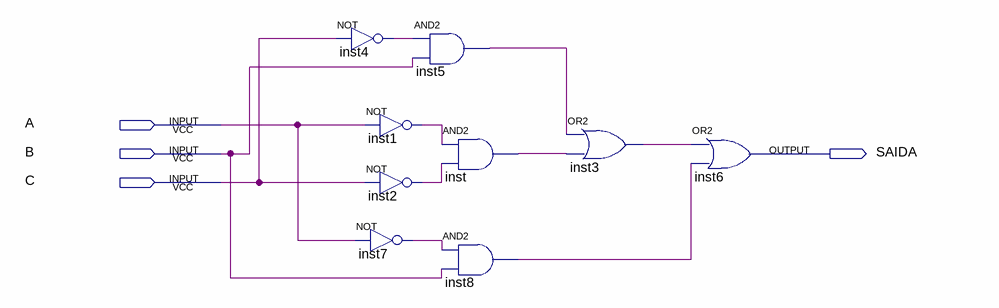
[diagram p0: schematic sheet]
// Quartus schematic Comp_Men.bdf as structural Verilog: 9 symbols, 4 pins
module Comp_Men (
  input  A,
  input  B,
  input  C,
  output SAIDA
);

  wire inst1_out, inst2_out, inst3_out, inst4_out, inst5_out, inst7_out, inst8_out, inst_out;

  not inst4 (inst4_out, C);
  not inst1 (inst1_out, A);
  not inst2 (inst2_out, C);
  not inst7 (inst7_out, A);
  and inst5 (inst5_out, inst4_out, B);
  and inst (inst_out, inst1_out, inst2_out);
  and inst8 (inst8_out, inst7_out, B);
  or inst3 (inst3_out, inst5_out, inst_out);
  or inst6 (SAIDA, inst3_out, inst8_out);
endmodule
